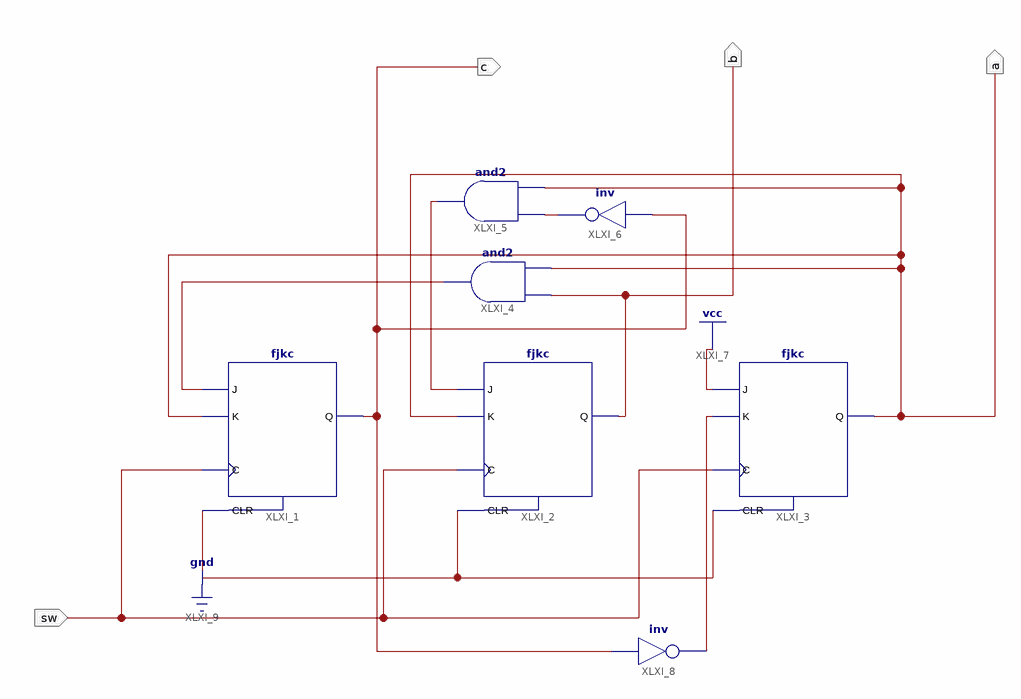
[diagram p0: schematic sheet 1]
// Xilinx ISE schematic nub15.sch (spartan6) as structural Verilog: 7 symbols, 4 ports
module nub15 (
  input  sw,
  output b,
  output a,
  output c
);

  wire XLXN_7, XLXN_10, XLXN_12, XLXN_18;

  fjkc XLXI_1 (.C(sw), .CLR(1'b0), .J(XLXN_7), .K(a), .Q(c));
  fjkc XLXI_2 (.C(sw), .CLR(1'b0), .J(XLXN_10), .K(a), .Q(b));
  fjkc XLXI_3 (.C(sw), .CLR(1'b0), .J(1'b1), .K(XLXN_18), .Q(a));
  and XLXI_4 (XLXN_7, a, b);
  and XLXI_5 (XLXN_10, a, XLXN_12);
  not XLXI_6 (XLXN_12, c);
  not XLXI_8 (XLXN_18, c);
endmodule
